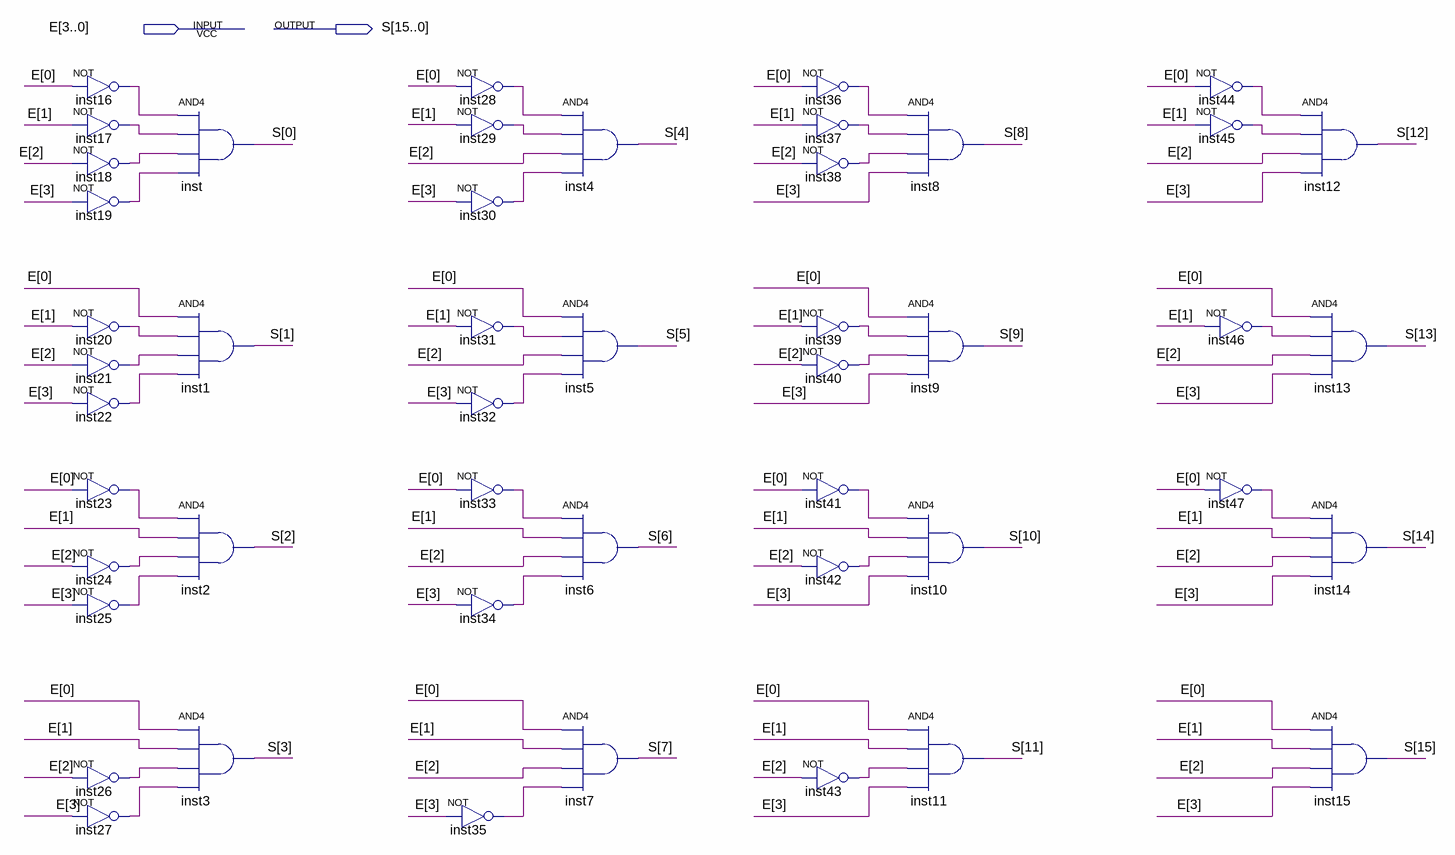
[diagram p0: schematic sheet]
// Quartus schematic Decod.bdf as structural Verilog: 48 symbols, 2 pins
module Decod (
  input  [3:0] E,
  output [15:0] S
);

  wire inst16_out, inst17_out, inst18_out, inst19_out, inst20_out, inst21_out, inst22_out, inst23_out,
       inst24_out, inst25_out, inst26_out, inst27_out, inst28_out, inst29_out, inst30_out, inst31_out,
       inst32_out, inst33_out, inst34_out, inst35_out, inst36_out, inst37_out, inst38_out, inst39_out,
       inst40_out, inst41_out, inst42_out, inst43_out, inst44_out, inst45_out, inst46_out, inst47_out;

  not inst16 (inst16_out, E[0]);
  not inst17 (inst17_out, E[1]);
  not inst18 (inst18_out, E[2]);
  not inst19 (inst19_out, E[3]);
  not inst20 (inst20_out, E[1]);
  not inst21 (inst21_out, E[2]);
  not inst22 (inst22_out, E[3]);
  not inst23 (inst23_out, E[0]);
  not inst24 (inst24_out, E[2]);
  not inst25 (inst25_out, E[3]);
  not inst26 (inst26_out, E[2]);
  not inst27 (inst27_out, E[3]);
  and inst (S[0], inst16_out, inst17_out, inst18_out, inst19_out);
  and inst1 (S[1], E[0], inst20_out, inst21_out, inst22_out);
  and inst2 (S[2], inst23_out, E[1], inst24_out, inst25_out);
  and inst3 (S[3], E[0], E[1], inst26_out, inst27_out);
  not inst28 (inst28_out, E[0]);
  not inst29 (inst29_out, E[1]);
  not inst30 (inst30_out, E[3]);
  not inst31 (inst31_out, E[1]);
  not inst32 (inst32_out, E[3]);
  not inst33 (inst33_out, E[0]);
  not inst34 (inst34_out, E[3]);
  not inst35 (inst35_out, E[3]);
  and inst4 (S[4], inst28_out, inst29_out, E[2], inst30_out);
  and inst5 (S[5], E[0], inst31_out, E[2], inst32_out);
  and inst6 (S[6], inst33_out, E[1], E[2], inst34_out);
  and inst7 (S[7], E[0], E[1], E[2], inst35_out);
  not inst36 (inst36_out, E[0]);
  not inst37 (inst37_out, E[1]);
  not inst38 (inst38_out, E[2]);
  not inst39 (inst39_out, E[1]);
  not inst40 (inst40_out, E[2]);
  not inst41 (inst41_out, E[0]);
  not inst42 (inst42_out, E[2]);
  not inst43 (inst43_out, E[2]);
  and inst8 (S[8], inst36_out, inst37_out, inst38_out, E[3]);
  and inst9 (S[9], E[0], inst39_out, inst40_out, E[3]);
  and inst10 (S[10], inst41_out, E[1], inst42_out, E[3]);
  and inst11 (S[11], E[0], E[1], inst43_out, E[3]);
  not inst44 (inst44_out, E[0]);
  not inst45 (inst45_out, E[1]);
  not inst46 (inst46_out, E[1]);
  not inst47 (inst47_out, E[0]);
  and inst12 (S[12], inst44_out, inst45_out, E[2], E[3]);
  and inst13 (S[13], E[0], inst46_out, E[2], E[3]);
  and inst14 (S[14], inst47_out, E[1], E[2], E[3]);
  and inst15 (S[15], E[0], E[1], E[2], E[3]);
endmodule
